# Altium schematic sheet 01_Top_Level.SchDoc
size A3; SheetNumber: 1; SheetTotal: 9
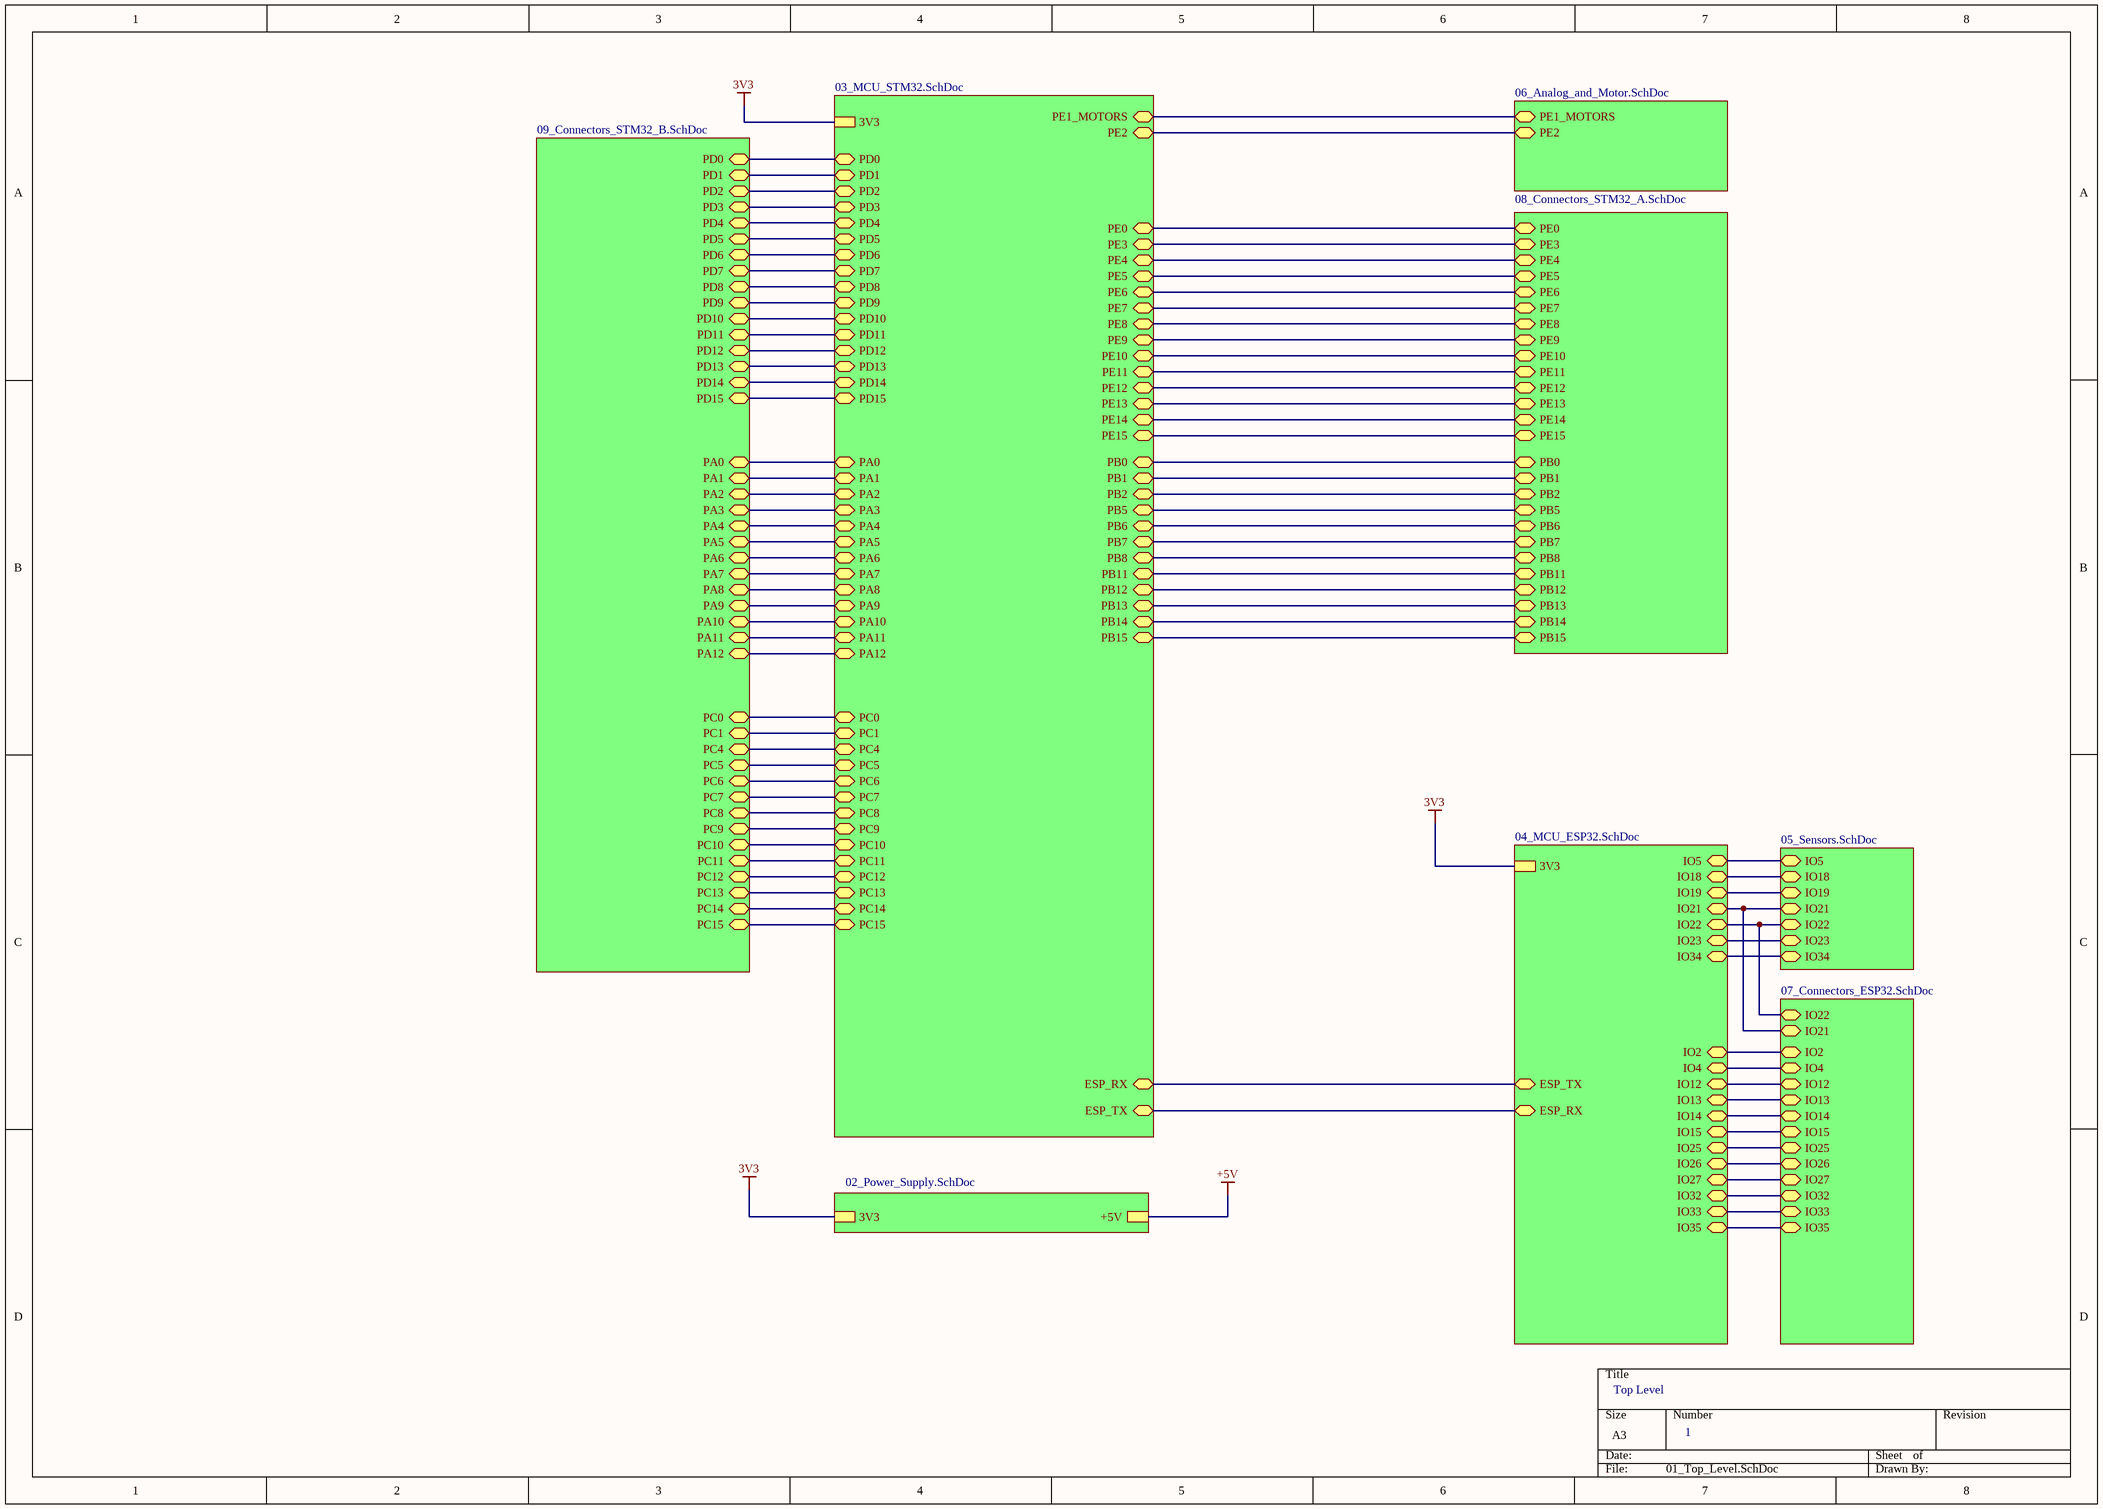
[diagram p0: 01_Top_Level.SchDoc]

## Sub-sheets
U_02_Power_Supply = 02_Power_Supply.SchDoc: +5V, 3V3
U_03_MCU_STM32 = 03_MCU_STM32.SchDoc: 3V3, PE0 (bidir), PE1_MOTORS (bidir), PE2 (bidir), PE3 (bidir), PE4 (bidir), PE5 (bidir), PE6 (bidir), PE7 (bidir), PE8 (bidir), PE9 (bidir), PE10 (bidir), PE11 (bidir), PE12 (bidir), PE13 (bidir), PE14 (bidir), PE15 (bidir), PB15 (bidir), PB14 (bidir), PB13 (bidir), PB12 (bidir), PB11 (bidir), PB8 (bidir), PB7 (bidir), PB6 (bidir), PB5 (bidir), PB2 (bidir), PB1 (bidir), PB0 (bidir), PD1 (bidir), PD2 (bidir), PD3 (bidir), PD4 (bidir), PD5 (bidir), PD6 (bidir), PD7 (bidir), PD8 (bidir), PD9 (bidir), PD10 (bidir), PD11 (bidir), PD12 (bidir), PD13 (bidir), PD14 (bidir), PD15 (bidir), PD0 (bidir), PA0 (bidir), PA1 (bidir), PA2 (bidir), PA3 (bidir), PA4 (bidir), PA5 (bidir), PA6 (bidir), PA7 (bidir), PA8 (bidir), PA9 (bidir), PA10 (bidir), PA11 (bidir), PA12 (bidir), PC0 (bidir), PC1 (bidir), PC4 (bidir), PC5 (bidir), PC6 (bidir), PC7 (bidir), PC8 (bidir), PC9 (bidir), PC10 (bidir), PC11 (bidir), PC12 (bidir), PC13 (bidir), PC14 (bidir), PC15 (bidir), ESP_RX (bidir), ESP_TX (bidir)
U_04_MCU_ESP32 = 04_MCU_ESP32.SchDoc: IO2 (bidir), IO4 (bidir), IO5 (bidir), IO12 (bidir), IO13 (bidir), IO14 (bidir), IO15 (bidir), ESP_RX (bidir), ESP_TX (bidir), IO18 (bidir), IO19 (bidir), IO21 (bidir), IO22 (bidir), IO23 (bidir), IO25 (bidir), IO26 (bidir), IO27 (bidir), IO32 (bidir), IO33 (bidir), IO34 (bidir), IO35 (bidir), 3V3
U_05_Sensors = 05_Sensors.SchDoc: IO21 (bidir), IO22 (bidir), IO5 (bidir), IO18 (bidir), IO23 (bidir), IO19 (bidir), IO34 (bidir)
U_06_Analog_and_Motor = 06_Analog_and_Motor.SchDoc: PE1_MOTORS (bidir), PE2 (bidir)
U_07_Connectors_ESP32 = 07_Connectors_ESP32.SchDoc: IO22 (bidir), IO21 (bidir), IO2 (bidir), IO4 (bidir), IO12 (bidir), IO13 (bidir), IO14 (bidir), IO15 (bidir), IO25 (bidir), IO26 (bidir), IO27 (bidir), IO32 (bidir), IO33 (bidir), IO35 (bidir)
U_08_Connectors_STM32_A = 08_Connectors_STM32_A.SchDoc: PE0 (bidir), PE3 (bidir), PE4 (bidir), PE5 (bidir), PE6 (bidir), PE7 (bidir), PE8 (bidir), PE9 (bidir), PE10 (bidir), PE11 (bidir), PE12 (bidir), PE13 (bidir), PE14 (bidir), PE15 (bidir), PB0 (bidir), PB1 (bidir), PB2 (bidir), PB5 (bidir), PB6 (bidir), PB7 (bidir), PB8 (bidir), PB11 (bidir), PB12 (bidir), PB13 (bidir), PB14 (bidir), PB15 (bidir)
U_09_Connectors_STM32_B = 09_Connectors_STM32_B.SchDoc: PD0 (bidir), PD1 (bidir), PD2 (bidir), PD3 (bidir), PD4 (bidir), PD5 (bidir), PD6 (bidir), PD7 (bidir), PD8 (bidir), PD9 (bidir), PD10 (bidir), PD11 (bidir), PD12 (bidir), PD13 (bidir), PD14 (bidir), PD15 (bidir), PA0 (bidir), PA1 (bidir), PA2 (bidir), PA3 (bidir), PA4 (bidir), PA5 (bidir), PA6 (bidir), PA7 (bidir), PA8 (bidir), PA9 (bidir), PA10 (bidir), PA11 (bidir), PA12 (bidir), PC0 (bidir), PC1 (bidir), PC4 (bidir), PC6 (bidir), PC8 (bidir), PC5 (bidir), PC7 (bidir), PC9 (bidir), PC10 (bidir), PC11 (bidir), PC12 (bidir), PC13 (bidir), PC14 (bidir), PC15 (bidir)

## Nets
3V3: sheet U_03_MCU_STM32/3V3, sheet U_02_Power_Supply/3V3, sheet U_04_MCU_ESP32/3V3
+5V: sheet U_02_Power_Supply/+5V
(unnamed): sheet U_03_MCU_STM32/PE0, sheet U_08_Connectors_STM32_A/PE0
(unnamed): sheet U_03_MCU_STM32/PE1_MOTORS, sheet U_06_Analog_and_Motor/PE1_MOTORS
(unnamed): sheet U_03_MCU_STM32/PE2, sheet U_06_Analog_and_Motor/PE2
(unnamed): sheet U_03_MCU_STM32/PE3, sheet U_08_Connectors_STM32_A/PE3
(unnamed): sheet U_03_MCU_STM32/PE4, sheet U_08_Connectors_STM32_A/PE4
(unnamed): sheet U_03_MCU_STM32/PE5, sheet U_08_Connectors_STM32_A/PE5
(unnamed): sheet U_03_MCU_STM32/PE6, sheet U_08_Connectors_STM32_A/PE6
(unnamed): sheet U_03_MCU_STM32/PE7, sheet U_08_Connectors_STM32_A/PE7
(unnamed): sheet U_03_MCU_STM32/PE8, sheet U_08_Connectors_STM32_A/PE8
(unnamed): sheet U_03_MCU_STM32/PE9, sheet U_08_Connectors_STM32_A/PE9
(unnamed): sheet U_03_MCU_STM32/PE10, sheet U_08_Connectors_STM32_A/PE10
(unnamed): sheet U_03_MCU_STM32/PE11, sheet U_08_Connectors_STM32_A/PE11
(unnamed): sheet U_03_MCU_STM32/PE12, sheet U_08_Connectors_STM32_A/PE12
(unnamed): sheet U_03_MCU_STM32/PE13, sheet U_08_Connectors_STM32_A/PE13
(unnamed): sheet U_03_MCU_STM32/PE14, sheet U_08_Connectors_STM32_A/PE14
(unnamed): sheet U_03_MCU_STM32/PE15, sheet U_08_Connectors_STM32_A/PE15
(unnamed): sheet U_03_MCU_STM32/PB15, sheet U_08_Connectors_STM32_A/PB15
(unnamed): sheet U_03_MCU_STM32/PB14, sheet U_08_Connectors_STM32_A/PB14
(unnamed): sheet U_03_MCU_STM32/PB13, sheet U_08_Connectors_STM32_A/PB13
(unnamed): sheet U_03_MCU_STM32/PB12, sheet U_08_Connectors_STM32_A/PB12
(unnamed): sheet U_03_MCU_STM32/PB11, sheet U_08_Connectors_STM32_A/PB11
(unnamed): sheet U_03_MCU_STM32/PB8, sheet U_08_Connectors_STM32_A/PB8
(unnamed): sheet U_03_MCU_STM32/PB7, sheet U_08_Connectors_STM32_A/PB7
(unnamed): sheet U_03_MCU_STM32/PB6, sheet U_08_Connectors_STM32_A/PB6
(unnamed): sheet U_03_MCU_STM32/PB5, sheet U_08_Connectors_STM32_A/PB5
(unnamed): sheet U_03_MCU_STM32/PB2, sheet U_08_Connectors_STM32_A/PB2
(unnamed): sheet U_03_MCU_STM32/PB1, sheet U_08_Connectors_STM32_A/PB1
(unnamed): sheet U_03_MCU_STM32/PB0, sheet U_08_Connectors_STM32_A/PB0
(unnamed): sheet U_03_MCU_STM32/PD1, sheet U_09_Connectors_STM32_B/PD1
(unnamed): sheet U_03_MCU_STM32/PD2, sheet U_09_Connectors_STM32_B/PD2
(unnamed): sheet U_03_MCU_STM32/PD3, sheet U_09_Connectors_STM32_B/PD3
(unnamed): sheet U_03_MCU_STM32/PD4, sheet U_09_Connectors_STM32_B/PD4
(unnamed): sheet U_03_MCU_STM32/PD5, sheet U_09_Connectors_STM32_B/PD5
(unnamed): sheet U_03_MCU_STM32/PD6, sheet U_09_Connectors_STM32_B/PD6
(unnamed): sheet U_03_MCU_STM32/PD7, sheet U_09_Connectors_STM32_B/PD7
(unnamed): sheet U_03_MCU_STM32/PD8, sheet U_09_Connectors_STM32_B/PD8
(unnamed): sheet U_03_MCU_STM32/PD9, sheet U_09_Connectors_STM32_B/PD9
(unnamed): sheet U_03_MCU_STM32/PD10, sheet U_09_Connectors_STM32_B/PD10
(unnamed): sheet U_03_MCU_STM32/PD11, sheet U_09_Connectors_STM32_B/PD11
(unnamed): sheet U_03_MCU_STM32/PD12, sheet U_09_Connectors_STM32_B/PD12
(unnamed): sheet U_03_MCU_STM32/PD13, sheet U_09_Connectors_STM32_B/PD13
(unnamed): sheet U_03_MCU_STM32/PD14, sheet U_09_Connectors_STM32_B/PD14
(unnamed): sheet U_03_MCU_STM32/PD15, sheet U_09_Connectors_STM32_B/PD15
(unnamed): sheet U_03_MCU_STM32/PD0, sheet U_09_Connectors_STM32_B/PD0
(unnamed): sheet U_03_MCU_STM32/PA0, sheet U_09_Connectors_STM32_B/PA0
(unnamed): sheet U_03_MCU_STM32/PA1, sheet U_09_Connectors_STM32_B/PA1
(unnamed): sheet U_03_MCU_STM32/PA2, sheet U_09_Connectors_STM32_B/PA2
(unnamed): sheet U_03_MCU_STM32/PA3, sheet U_09_Connectors_STM32_B/PA3
(unnamed): sheet U_03_MCU_STM32/PA4, sheet U_09_Connectors_STM32_B/PA4
(unnamed): sheet U_03_MCU_STM32/PA5, sheet U_09_Connectors_STM32_B/PA5
(unnamed): sheet U_03_MCU_STM32/PA6, sheet U_09_Connectors_STM32_B/PA6
(unnamed): sheet U_03_MCU_STM32/PA7, sheet U_09_Connectors_STM32_B/PA7
(unnamed): sheet U_03_MCU_STM32/PA8, sheet U_09_Connectors_STM32_B/PA8
(unnamed): sheet U_03_MCU_STM32/PA9, sheet U_09_Connectors_STM32_B/PA9
(unnamed): sheet U_03_MCU_STM32/PA10, sheet U_09_Connectors_STM32_B/PA10
(unnamed): sheet U_03_MCU_STM32/PA11, sheet U_09_Connectors_STM32_B/PA11
(unnamed): sheet U_03_MCU_STM32/PA12, sheet U_09_Connectors_STM32_B/PA12
(unnamed): sheet U_03_MCU_STM32/PC0, sheet U_09_Connectors_STM32_B/PC0
(unnamed): sheet U_03_MCU_STM32/PC1, sheet U_09_Connectors_STM32_B/PC1
(unnamed): sheet U_03_MCU_STM32/PC4, sheet U_09_Connectors_STM32_B/PC4
(unnamed): sheet U_03_MCU_STM32/PC5, sheet U_09_Connectors_STM32_B/PC5
(unnamed): sheet U_03_MCU_STM32/PC6, sheet U_09_Connectors_STM32_B/PC6
(unnamed): sheet U_03_MCU_STM32/PC7, sheet U_09_Connectors_STM32_B/PC7
(unnamed): sheet U_03_MCU_STM32/PC8, sheet U_09_Connectors_STM32_B/PC8
(unnamed): sheet U_03_MCU_STM32/PC9, sheet U_09_Connectors_STM32_B/PC9
(unnamed): sheet U_03_MCU_STM32/PC10, sheet U_09_Connectors_STM32_B/PC10
(unnamed): sheet U_03_MCU_STM32/PC11, sheet U_09_Connectors_STM32_B/PC11
(unnamed): sheet U_03_MCU_STM32/PC12, sheet U_09_Connectors_STM32_B/PC12
(unnamed): sheet U_03_MCU_STM32/PC13, sheet U_09_Connectors_STM32_B/PC13
(unnamed): sheet U_03_MCU_STM32/PC14, sheet U_09_Connectors_STM32_B/PC14
(unnamed): sheet U_03_MCU_STM32/PC15, sheet U_09_Connectors_STM32_B/PC15
(unnamed): sheet U_03_MCU_STM32/ESP_RX, sheet U_04_MCU_ESP32/ESP_TX
(unnamed): sheet U_03_MCU_STM32/ESP_TX, sheet U_04_MCU_ESP32/ESP_RX
(unnamed): sheet U_04_MCU_ESP32/IO2, sheet U_07_Connectors_ESP32/IO2
(unnamed): sheet U_04_MCU_ESP32/IO4, sheet U_07_Connectors_ESP32/IO4
(unnamed): sheet U_04_MCU_ESP32/IO5, sheet U_05_Sensors/IO5
(unnamed): sheet U_04_MCU_ESP32/IO12, sheet U_07_Connectors_ESP32/IO12
(unnamed): sheet U_04_MCU_ESP32/IO13, sheet U_07_Connectors_ESP32/IO13
(unnamed): sheet U_04_MCU_ESP32/IO14, sheet U_07_Connectors_ESP32/IO14
(unnamed): sheet U_04_MCU_ESP32/IO15, sheet U_07_Connectors_ESP32/IO15
(unnamed): sheet U_04_MCU_ESP32/IO18, sheet U_05_Sensors/IO18
(unnamed): sheet U_04_MCU_ESP32/IO19, sheet U_05_Sensors/IO19
(unnamed): sheet U_04_MCU_ESP32/IO21, sheet U_05_Sensors/IO21, sheet U_07_Connectors_ESP32/IO21
(unnamed): sheet U_04_MCU_ESP32/IO22, sheet U_05_Sensors/IO22, sheet U_07_Connectors_ESP32/IO22
(unnamed): sheet U_04_MCU_ESP32/IO23, sheet U_05_Sensors/IO23
(unnamed): sheet U_04_MCU_ESP32/IO25, sheet U_07_Connectors_ESP32/IO25
(unnamed): sheet U_04_MCU_ESP32/IO26, sheet U_07_Connectors_ESP32/IO26
(unnamed): sheet U_04_MCU_ESP32/IO27, sheet U_07_Connectors_ESP32/IO27
(unnamed): sheet U_04_MCU_ESP32/IO32, sheet U_07_Connectors_ESP32/IO32
(unnamed): sheet U_04_MCU_ESP32/IO33, sheet U_07_Connectors_ESP32/IO33
(unnamed): sheet U_04_MCU_ESP32/IO34, sheet U_05_Sensors/IO34
(unnamed): sheet U_04_MCU_ESP32/IO35, sheet U_07_Connectors_ESP32/IO35

## Notes on the sheet
- Top Level
- 1